# Altium schematic sheet Filters.SchDoc
size 381 x 241 mm
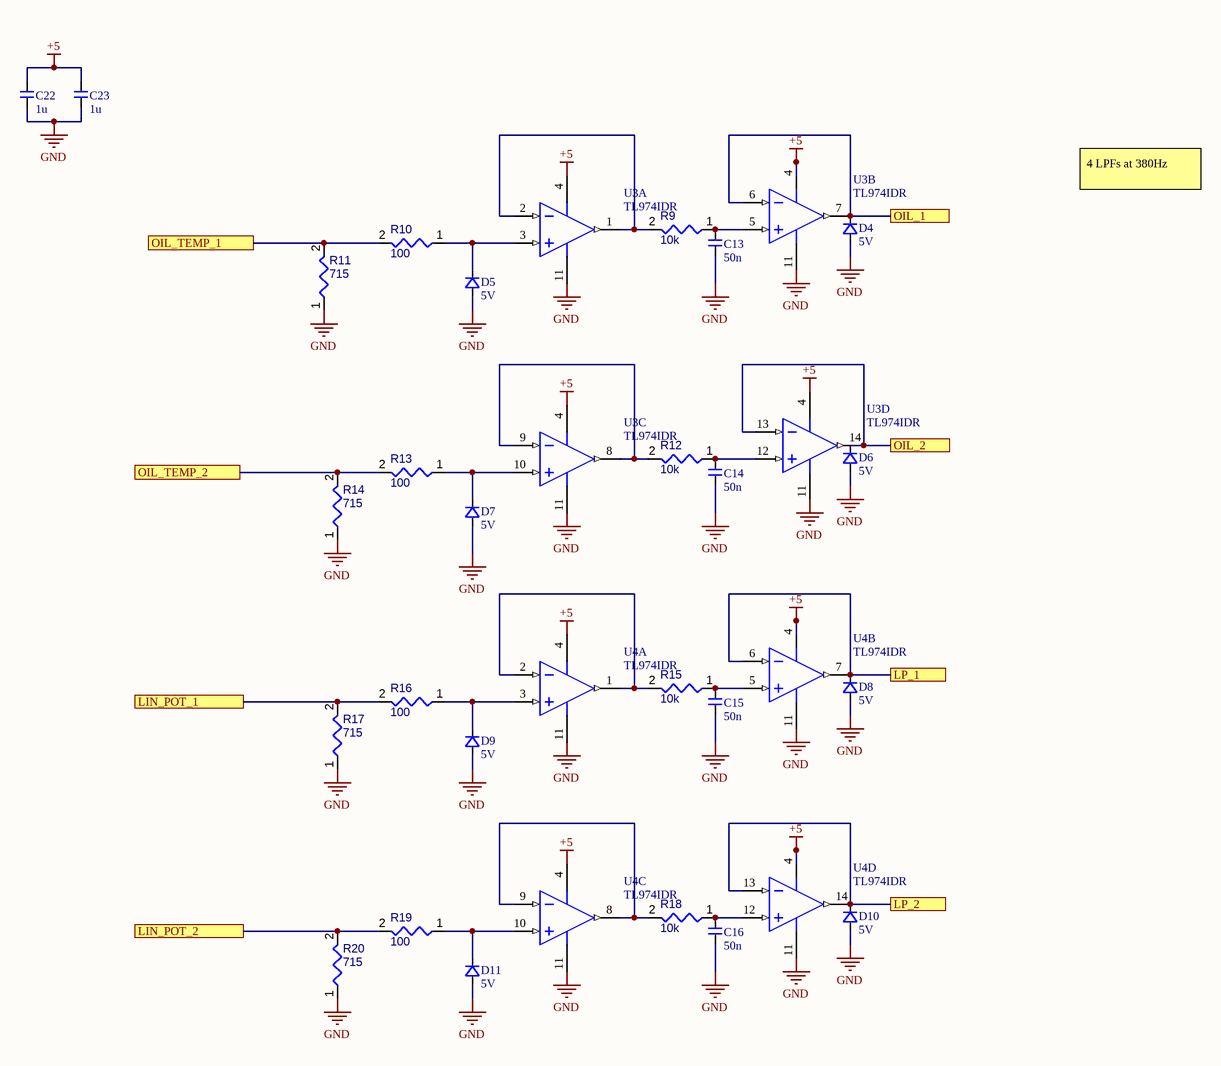
[diagram p0: Filters.SchDoc]

## Parts
C13  50n  [CAP-0603]
C14  50n  [CAP-0603]
C15  50n  [CAP-0603]
C16  50n  [CAP-0603]
C22  1u  [CAP-0603]
C23  1u  [CAP-0603]
D4  5V  [SOD123]
D5  5V  [SOD123]
D6  5V  [SOD123]
D7  5V  [SOD123]
D8  5V  [SOD123]
D9  5V  [SOD123]
D10  5V  [SOD123]
D11  5V  [SOD123]
R9  10k  [RESC0805(2012)_L]
R10  100  [RESC0805(2012)_L]
R11  715  [RESC0805(2012)_L]
R12  10k  [RESC0805(2012)_L]
R13  100  [RESC0805(2012)_L]
R14  715  [RESC0805(2012)_L]
R15  10k  [RESC0805(2012)_L]
R16  100  [RESC0805(2012)_L]
R17  715  [RESC0805(2012)_L]
R18  10k  [RESC0805(2012)_L]
R19  100  [RESC0805(2012)_L]
R20  715  [RESC0805(2012)_L]
U3  TL974IDR  [D0014A_M]  (parts A,B,C,D of 4)
U4  TL974IDR  [D0014A_M]  (parts A,B,C,D of 4)

## Ports
LIN_POT_1, LIN_POT_2, LP_1, LP_2, OIL_1, OIL_2, OIL_TEMP_1, OIL_TEMP_2

## Nets
+5: C22.2 C23.2 U3.4(VCC+) U4.4(VCC+)
GND: C13.1 C14.1 C15.1 C16.1 C22.1 C23.1 D4.A D5.A D6.A D7.A D8.A D9.A D10.A D11.A R11.1 R14.1 R17.1 R20.1 U3.11(VCC-) U4.11(VCC-)
LIN_POT_1: R16.2 R17.2 ; port LIN_POT_1
LIN_POT_2: R19.2 R20.2 ; port LIN_POT_2
LP_1: D8.K U4.6(IN2-) U4.7(OUT2) ; port LP_1
LP_2: D10.K U4.13(IN4-) U4.14(OUT4) ; port LP_2
OIL_1: D4.K U3.6(IN2-) U3.7(OUT2) ; port OIL_1
OIL_2: D6.K U3.13(IN4-) U3.14(OUT4) ; port OIL_2
OIL_TEMP_1: R10.2 R11.2 ; port OIL_TEMP_1
OIL_TEMP_2: R13.2 R14.2 ; port OIL_TEMP_2
NetC13_2: C13.2 R9.1 U3.5(IN2+)
NetC14_2: C14.2 R12.1 U3.12(IN4+)
NetC15_2: C15.2 R15.1 U4.5(IN2+)
NetC16_2: C16.2 R18.1 U4.12(IN4+)
NetD5_K: D5.K R10.1 U3.3(IN1+)
NetD7_K: D7.K R13.1 U3.10(IN3+)
NetD9_K: D9.K R16.1 U4.3(IN1+)
NetD11_K: D11.K R19.1 U4.10(IN3+)
NetR9_2: R9.2 U3.1(OUT1) U3.2(IN1-)
NetR12_2: R12.2 U3.8(OUT3) U3.9(IN3-)
NetR15_2: R15.2 U4.1(OUT1) U4.2(IN1-)
NetR18_2: R18.2 U4.8(OUT3) U4.9(IN3-)

## Notes on the sheet
- 4 LPFs at 380Hz

## Library data of the parts
C13-C16 = CMP-050-000071-1: Source: ife19_Elec_Library.SchLib; Design Item ID: CAP-0603
C22 C23 = CMP-005-000671-1: Design Item ID: CAP-0603; Source: ife19_Elec_Library.SchLib
D4-D11 = CMP-051-000177-1: Design Item ID: DIODE-SOD123; Source: ife19_Elec_Library.SchLib
R9-R20 = CMP-009-000172-1: Chip Resistor, 120 Ohms, +/-5 %, 0.1 W, -55 to 155 degC, 0603; Value: 120; Power: 100mW; Tolerance: 5%; Available Preview Images: 2D; Max Operating Temperature: 155°C; Min Operating Temperature: -55°C; Case/Package: 0603; Pins: 2; Source: Integrated_Library - 12.03.21 - 15.39.SchLib; Design Item ID: CMP-009-00176-2
U3 U4 = CMP-0015-00021-2: Output Rail-To-Rail Very-Low-Noise Operational Amplifier, 2.7 to 12 V, -40 to 125 degC, 14-pin SOIC (D14), Green (RoHS & no Sb/Br); Manufacturer: Texas Instruments; GBW(Typ)(MHz): 12; Vio (25C)(Max)(mV): 4; Offset Drift(Typ)(uV/C): 5; IIB(Max)(pA): 750000; Sub Family: General Purpose Amplifier, Low Supply Voltage Amplifier (<=2.7V); Total Supply Voltage(Min)(+5V is 5, +/-5V is 10): 2.7; Iq per channel(Max)(mA): 2.8; Rating: Catalog; CMRR(Min)(dB): 60; PackageReference: D0014A; DatasheetVersion: SLOS467G; Code_JEDEC: MS-012; PartNumber: TL974IDR; ComponentLink3Description: Package Specification; Number of Channels: 4; Slew Rate(Typ)(V/us): 5; Mounting Technology: Surface Mount; ComponentLink2Description: Datasheet; Eco-Plan: Green (RoHS & no Sb/Br); ComponentLink1Description: Manufacturer URL; ComponentLink2URL: http://www.ti.com/lit/ds/symlink/tl974.pdf; ComponentLink1URL: http://www.ti.com/; Total Supply Voltage(Max)(+5V is 5, +/-5V is 10): 12; PackageDescription: 14-Pin Plastic Small Outline, Body 8.65 x 3.90 mm, Pitch 1.27 mm; PackageVersion: 4040047-5/M, 06/2011; ComponentLink3URL: http://www.ti.com/lit/ml/mpds177g/mpds177g.pdf